# EAGLE design DuplexCable (EAGLE 7.0.0)
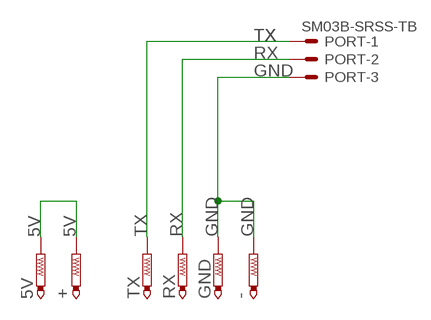
[diagram p0: schematic, sheet 1]

## Parts
5V  PTR1PAD1-13  [P1-13]
+  PTR1PAD1-13  [P1-13]
-  PTR1PAD1-13  [P1-13]
GND  PTR1PAD1-13  [P1-13]
PORT  SM03B-SRSS-TB  [SM03B-SRSS-TB]
RX  PTR1PAD1-13  [P1-13]
TX  PTR1PAD1-13  [P1-13]

## Nets
5V: 5V.TP +.TP
GND: -.TP GND.TP PORT.3
RX: PORT.2 RX.TP
TX: PORT.1 TX.TP

## Library data of the parts
5V + - GND RX TX = testpad:PTR1: TEST PIN
PORT = con-jst2:?M03B-SRSS-TB: Disconnectable Crimp style connector, 1.0mm pitch 3 contacts; OC_FARNELL: 1679118

## Board
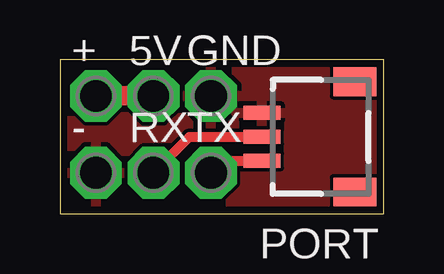
[diagram p1: board, top side]
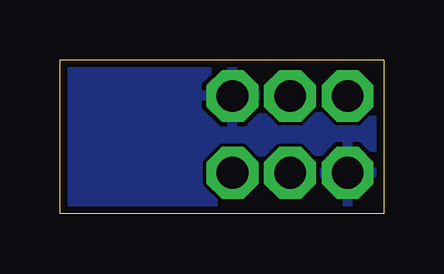
[diagram p2: board, bottom side, seen from below]

Size 13.5 x 6.4 mm. Coordinates in mm from the lower left corner, seen from the top.
Outline: 0,0 13.5,0 13.5,6.4 0,6.4 0,0
Copper layers (1*16): Top 0.035mm / dielectric 1.5mm / Bottom 0.035mm
Design rules "PCB-POOL Standard": minimum track width 0.15mm, minimum drill 0.3mm, track to track 0.15mm, track to pad 0.15mm, pad to pad 0.15mm, via to via 0.15mm, smd to smd 0.15mm, copper to edge 0.3mm, drill to drill 0.2mm, minimum pad ring 0.2mm, minimum via ring 0.15mm, stop-mask expansion 0.075mm, vias tented up to drill 0mil, thermal gap 0.2mm

### Footprints (pad centres in the part's own frame; a part is rotated, then mirrored left to right if it is on the bottom)
P1-13 = drill 1.321 pad 2.159 octagon: TP 0,0
SM03B-SRSS-TB = smd 0.6 x 1.55: 1 -1,2.975; 2 0,2.975; 3 1,2.975 | smd 1.2 x 1.8: FIT@1 -2.3,-0.9; FIT@2 2.3,-0.9

### Placement (x,y rotation side)
5V  3.9,4.9 0 top
+  1.5,4.9 0 top
-  1.5,1.7 0 top
GND  6.3,4.9 0 top
PORT  11.4,3.2 90 top
RX  3.9,1.7 0 top
TX  6.3,1.7 0 top

### Tracks (layer width: path | path; a pad name or v marks a point on that pad's centre or on a via)
5V
  Top 0.813: +.TP 5V.TP
GND
  pour Top: 0,6.7 14.6,6.7 14.6,-0.3 0,-0.3
  pour Bottom: -0.1,6.5 14.1,6.5 14.1,3.9 14.1,-0.2 3.4,-0.2 -0.1,-0.2
RX
  Top 0.406: RX.TP 5.4,3.2 PORT.2
TX
  Top 0.406: TX.TP 6.8,2.2 PORT.1